# Altium schematic sheet pwrmeas.SchDoc
size A4; Organization: UNSW Solar Racing Team; Address3: UNSW; Address4: Sydney NSW 2052; Address2: Electrical Engineering; Address1: Room 342
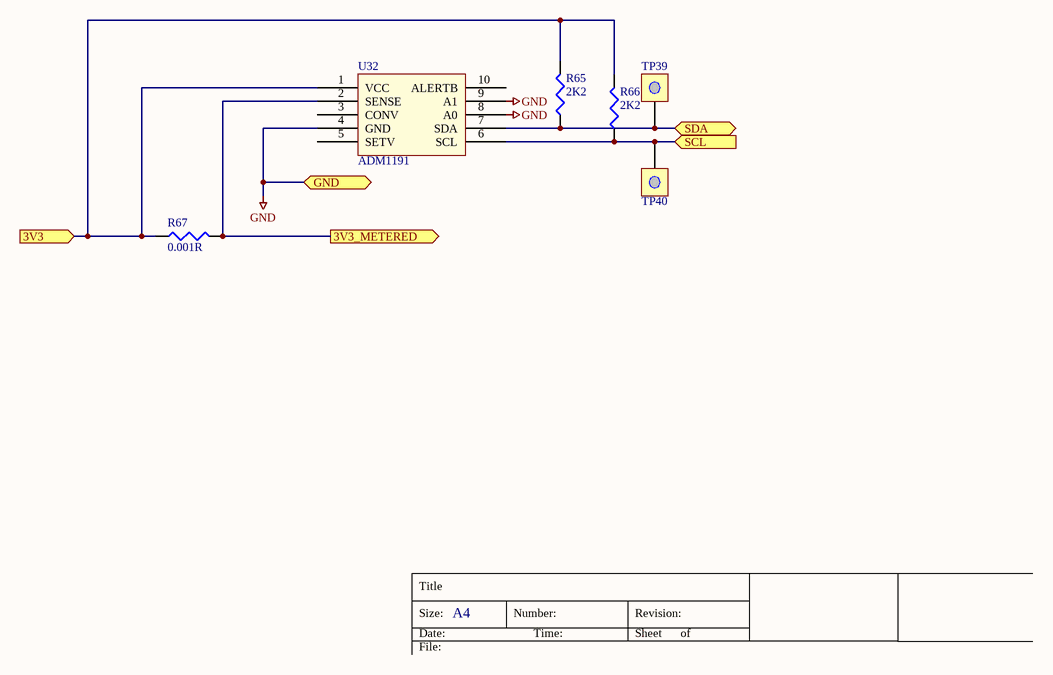
[diagram p0: pwrmeas.SchDoc]

## Parts
R65  2K2  [0603]
R66  2K2  [0603]
R67  0.001R  [CRA2512]
TP39  SDA  [TESTPOINT]  (value not drawn)
TP40  SCL  [TESTPOINT]  (value not drawn)
U32  ADM1191  [MSOP10]

## Ports
3V3 (in), 3V3_METERED (out), GND, SCL (in), SDA (bidir)

## Nets
GND: U32.4(GND) U32.8(A0) U32.9(A1) ; port GND
3V3: R65.2 R66.2 R67.1 U32.1(VCC) ; port 3V3
3V3_METERED: R67.2 U32.2(SENSE) ; port 3V3_METERED
SCL: R66.1 TP40.0(TP) U32.6(SCL) ; port SCL
SDA: R65.1 TP39.0(TP) U32.7(SDA) ; port SDA

Not connected (* = marked no-connect by the designer): U32 3(CONV) 5(SETV) 10(ALERTB)

## Notes on the sheet
- Title
- Size:
- Date:
- A4
- Number:
- Time:
- Revision:
- Sheet
- of
- File:

## Library data of the parts
R65-R67 = RES1: Resistor
  R67: Digikey: P1.0NDCT-ND; DigikeyPrice: 1.18
TP39 TP40 = TEST: TEST POINT
U32 = ADM1191: Digital I2C Power Monitor; Digikey: ADM1191-2ARMZ-R7CT-ND; DigikeyPrice: 4.92